# Altium schematic sheet TOP.SchDoc
size A4; DocumentNumber: 1; SheetNumber: 1; SheetTotal: 4
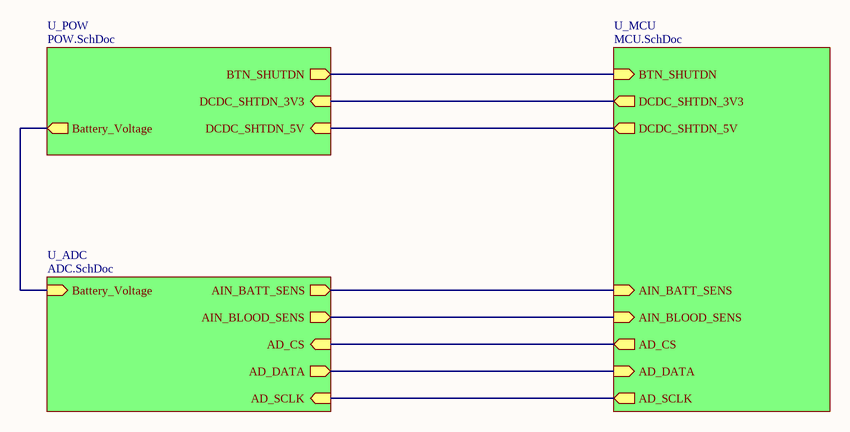
[diagram p0: TOP.SchDoc]

## Sub-sheets
U_ADC = ADC.SchDoc: AIN_BLOOD_SENS (out), AD_CS (in), AD_DATA (out), AD_SCLK (in), Battery_Voltage (in), AIN_BATT_SENS (out)
U_MCU = MCU.SchDoc: BTN_SHUTDN (in), AIN_BLOOD_SENS (in), AD_CS (out), AD_DATA (in), AD_SCLK (out), DCDC_SHTDN_3V3 (out), DCDC_SHTDN_5V (out), AIN_BATT_SENS (in)
U_POW = POW.SchDoc: DCDC_SHTDN_3V3 (in), DCDC_SHTDN_5V (in), BTN_SHUTDN (out), Battery_Voltage (out)

## Nets
(unnamed): sheet U_ADC/AIN_BLOOD_SENS, sheet U_MCU/AIN_BLOOD_SENS
(unnamed): sheet U_ADC/AD_CS, sheet U_MCU/AD_CS
(unnamed): sheet U_ADC/AD_DATA, sheet U_MCU/AD_DATA
(unnamed): sheet U_ADC/AD_SCLK, sheet U_MCU/AD_SCLK
(unnamed): sheet U_ADC/Battery_Voltage, sheet U_POW/Battery_Voltage
(unnamed): sheet U_ADC/AIN_BATT_SENS, sheet U_MCU/AIN_BATT_SENS
(unnamed): sheet U_MCU/BTN_SHUTDN, sheet U_POW/BTN_SHUTDN
(unnamed): sheet U_MCU/DCDC_SHTDN_3V3, sheet U_POW/DCDC_SHTDN_3V3
(unnamed): sheet U_MCU/DCDC_SHTDN_5V, sheet U_POW/DCDC_SHTDN_5V

## Notes on the sheet
- Project Title:
- Project No:
- Size:
- Date:
- A4
- Rev:
- Page Title:
- Sheet:
- of